# Altium schematic sheet 11 pcie.SchDoc
size A3; SheetNumber: 15; SheetTotal: 16
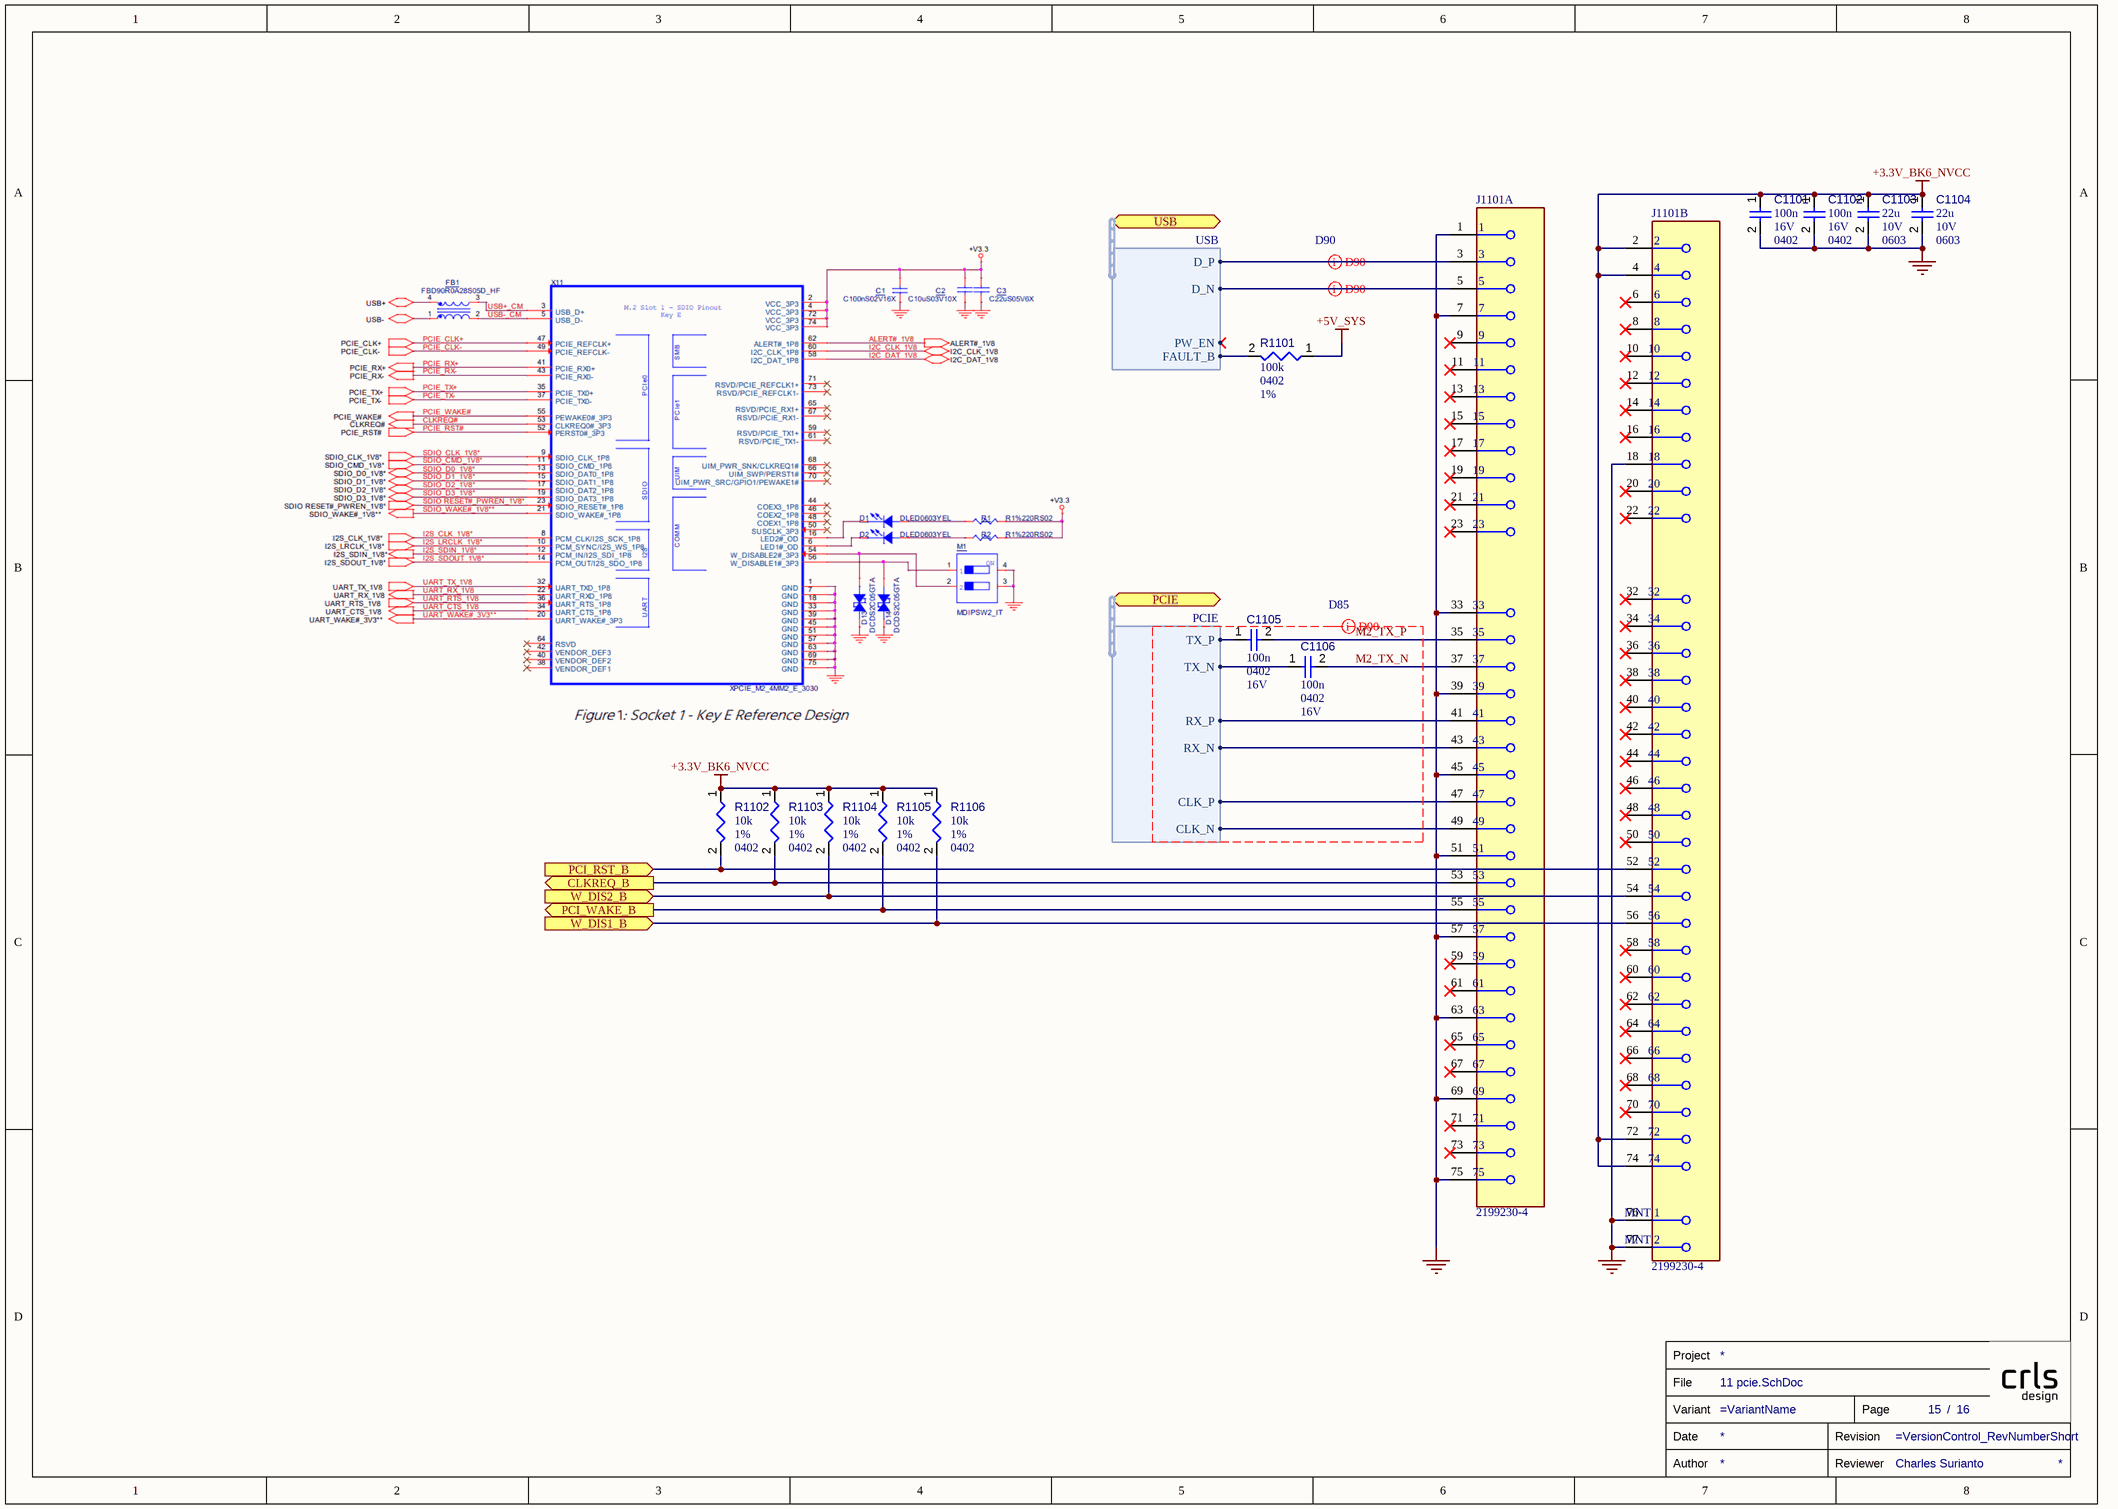
[diagram p0: 11 pcie.SchDoc]

## Parts
C1101  value 100n  Case/Package: 0402  Voltage Rating: 16V  [CAPC0402(1005)60_L]  (hidden comment: Capacitors,0402,100n,16V)
C1102  value 100n  Case/Package: 0402  Voltage Rating: 16V  [CAPC0402(1005)60_L]  (hidden comment: Capacitors,0402,100n,16V)
C1103  value 22u  Case/Package: 0603  Voltage Rating: 10V  [CAPC0603(1608)100_L]  (hidden comment: Capacitors,0603,22u,10V)
C1104  value 22u  Case/Package: 0603  Voltage Rating: 10V  [CAPC0603(1608)100_L]  (hidden comment: Capacitors,0603,22u,10V)
C1105  value 100n  Case/Package: 0402  Voltage Rating: 16V  [CAPC0402(1005)60_L]  (hidden comment: Capacitors,0402,100n,16V)
C1106  value 100n  Case/Package: 0402  Voltage Rating: 16V  [CAPC0402(1005)60_L]  (hidden comment: Capacitors,0402,100n,16V)
J1101  2199230-4  [FP-2199230-4-MFG]  (parts A,B of 2)
R1101  value 100k  Case/Package: 0402  Tolerance: 1%  [RESC0402(1005)_L]  (hidden comment: Resistors,0402,1%,100k)
R1102  value 10k  Case/Package: 0402  Tolerance: 1%  [RESC0402(1005)_L]  (hidden comment: Resistors,0402,1%,10k)
R1103  value 10k  Case/Package: 0402  Tolerance: 1%  [RESC0402(1005)_L]  (hidden comment: Resistors,0402,1%,10k)
R1104  value 10k  Case/Package: 0402  Tolerance: 1%  [RESC0402(1005)_L]  (hidden comment: Resistors,0402,1%,10k)
R1105  value 10k  Case/Package: 0402  Tolerance: 1%  [RESC0402(1005)_L]  (hidden comment: Resistors,0402,1%,10k)
R1106  value 10k  Case/Package: 0402  Tolerance: 1%  [RESC0402(1005)_L]  (hidden comment: Resistors,0402,1%,10k)
TB?  Reviewer: Charles Surianto  (hidden comment: TITLE_BLOCK)  (graphical)

## Ports
CLKREQ_B (out), PCI_RST_B (in), PCI_WAKE_B (out), PCIE (bidir, harness PCIE), USB (bidir, harness USB), W_DIS1_B (in), W_DIS2_B (in)

## Harnesses
PCIE: TX_N, RX_P, RX_N, CLK_N, CLK_P, TX_P
USB: D_P, D_N, FAULT_B, PW_EN

## Nets
+3.3V_BK6_NVCC: C1101.1 C1102.1 C1103.1 C1104.1 J1101.2 J1101.4 J1101.72 J1101.74 R1102.1 R1103.1 R1104.1 R1105.1 R1106.1
+5V_SYS: R1101.1
GND: C1101.2 C1102.2 C1103.2 C1104.2 J1101.1 J1101.7 J1101.18 J1101.33 J1101.39 J1101.45 J1101.51 J1101.57 J1101.63 J1101.69 J1101.75 J1101.76(MNT_1) J1101.77(MNT_2)
CLKREQ_B: J1101.53 R1103.2 ; port CLKREQ_B
M2_TX_N: C1106.2 J1101.37
M2_TX_P: C1105.2 J1101.35
PCI_RST_B: J1101.52 R1102.2 ; port PCI_RST_B
PCI_WAKE_B: J1101.55 R1105.2 ; port PCI_WAKE_B
W_DIS1_B: J1101.56 R1106.2 ; port W_DIS1_B
W_DIS2_B: J1101.54 R1104.2 ; port W_DIS2_B
NetC1105_1: C1105.1 ; port PCIE.TX_P
NetC1106_1: C1106.1 ; port PCIE.TX_N
NetJ1101_3: J1101.3 ; port USB.D_P
NetJ1101_5: J1101.5 ; port USB.D_N
NetJ1101_41: J1101.41 ; port PCIE.RX_P
NetJ1101_43: J1101.43 ; port PCIE.RX_N
NetJ1101_47: J1101.47 ; port PCIE.CLK_P
NetJ1101_49: J1101.49 ; port PCIE.CLK_N
NetR1101_2: R1101.2 ; port USB.FAULT_B

Not connected (* = marked no-connect by the designer): J1101 6* 8* 9* 10* 11* 12* 13* 14* 15* 16* 17* 19* 20* 21* 22* 23* 32* 34* 36* 38* 40* 42* 44* 46* 48* 50* 58* 59* 60* 61* 62* 64* 65* 66* 67* 68* 70* 71* 73*

## Layout directives
differential pair; differential pair class D85: M2_TX_N, M2_TX_P
differential pair; differential pair class D90: NetJ1101_3, NetJ1101_5

## Notes on the sheet
- (in symbol TITLE_BLOCK) Project; File; Variant; Page; /; Date; Revision; Author; Reviewer

## Library data of the parts
C1101-C1106 = Capacitors: Capacitor; Component Type: Capacitors
J1101 = CMP-03365-000002-1: CONN FEMALE 67POS 0.020 GOLD; Manufacturer: TE Connectivity; Conn Orientation: Right Angle; Pitch: 0.5mm; Number Of Contacts: 67; Voltage Rating: 50V; Is Female: yes; Current Rating: 0.5A; Lead Free: Yes; Temperature Range Low: -40°C; Device Class L3: unset; Package: 0; Manufacturer Part Number: 2199230-4; RoHS: TRUE; Digikey Description: CONN FEMALE 67POS 0.020 GOLD; Category: Conn; Device Class L1: Connectors; Temperature Range High: +80°C; ComponentLink2Description: Datasheet; ComponentLink2URL: https://www.te.com/commerce/DocumentDelivery/DDEController?Action=showdoc&DocId=Customer+Drawing%7F2199230%7FB3%7Fpdf%7FEnglish%7FENG_CD_2199230_B3.pdf%7F2199230-4; Mouser Description: PCI Express / PCI Connectors .5PITCH 4.2H KEY E EMBOSS NGFF MINICARD; Automotive: No; Conn Gender: Female; Height: 4.2mm; Device Class L2: Card Edge Connectors; Contact Material: Gold,Nickel; Number Of Rows: 2; Octopart: https://octopart.com/2199230-4-te+connectivity-46436156; Temperature: -40°C to +80°C
R1101-R1106 = Resistors: Resistor; Component Type: Resistors
TB? = TITLE_BLOCK: Review Date: *